# EAGLE schematic Becca Sap Flow Power Board v1_2 (EAGLE 9.6.2)
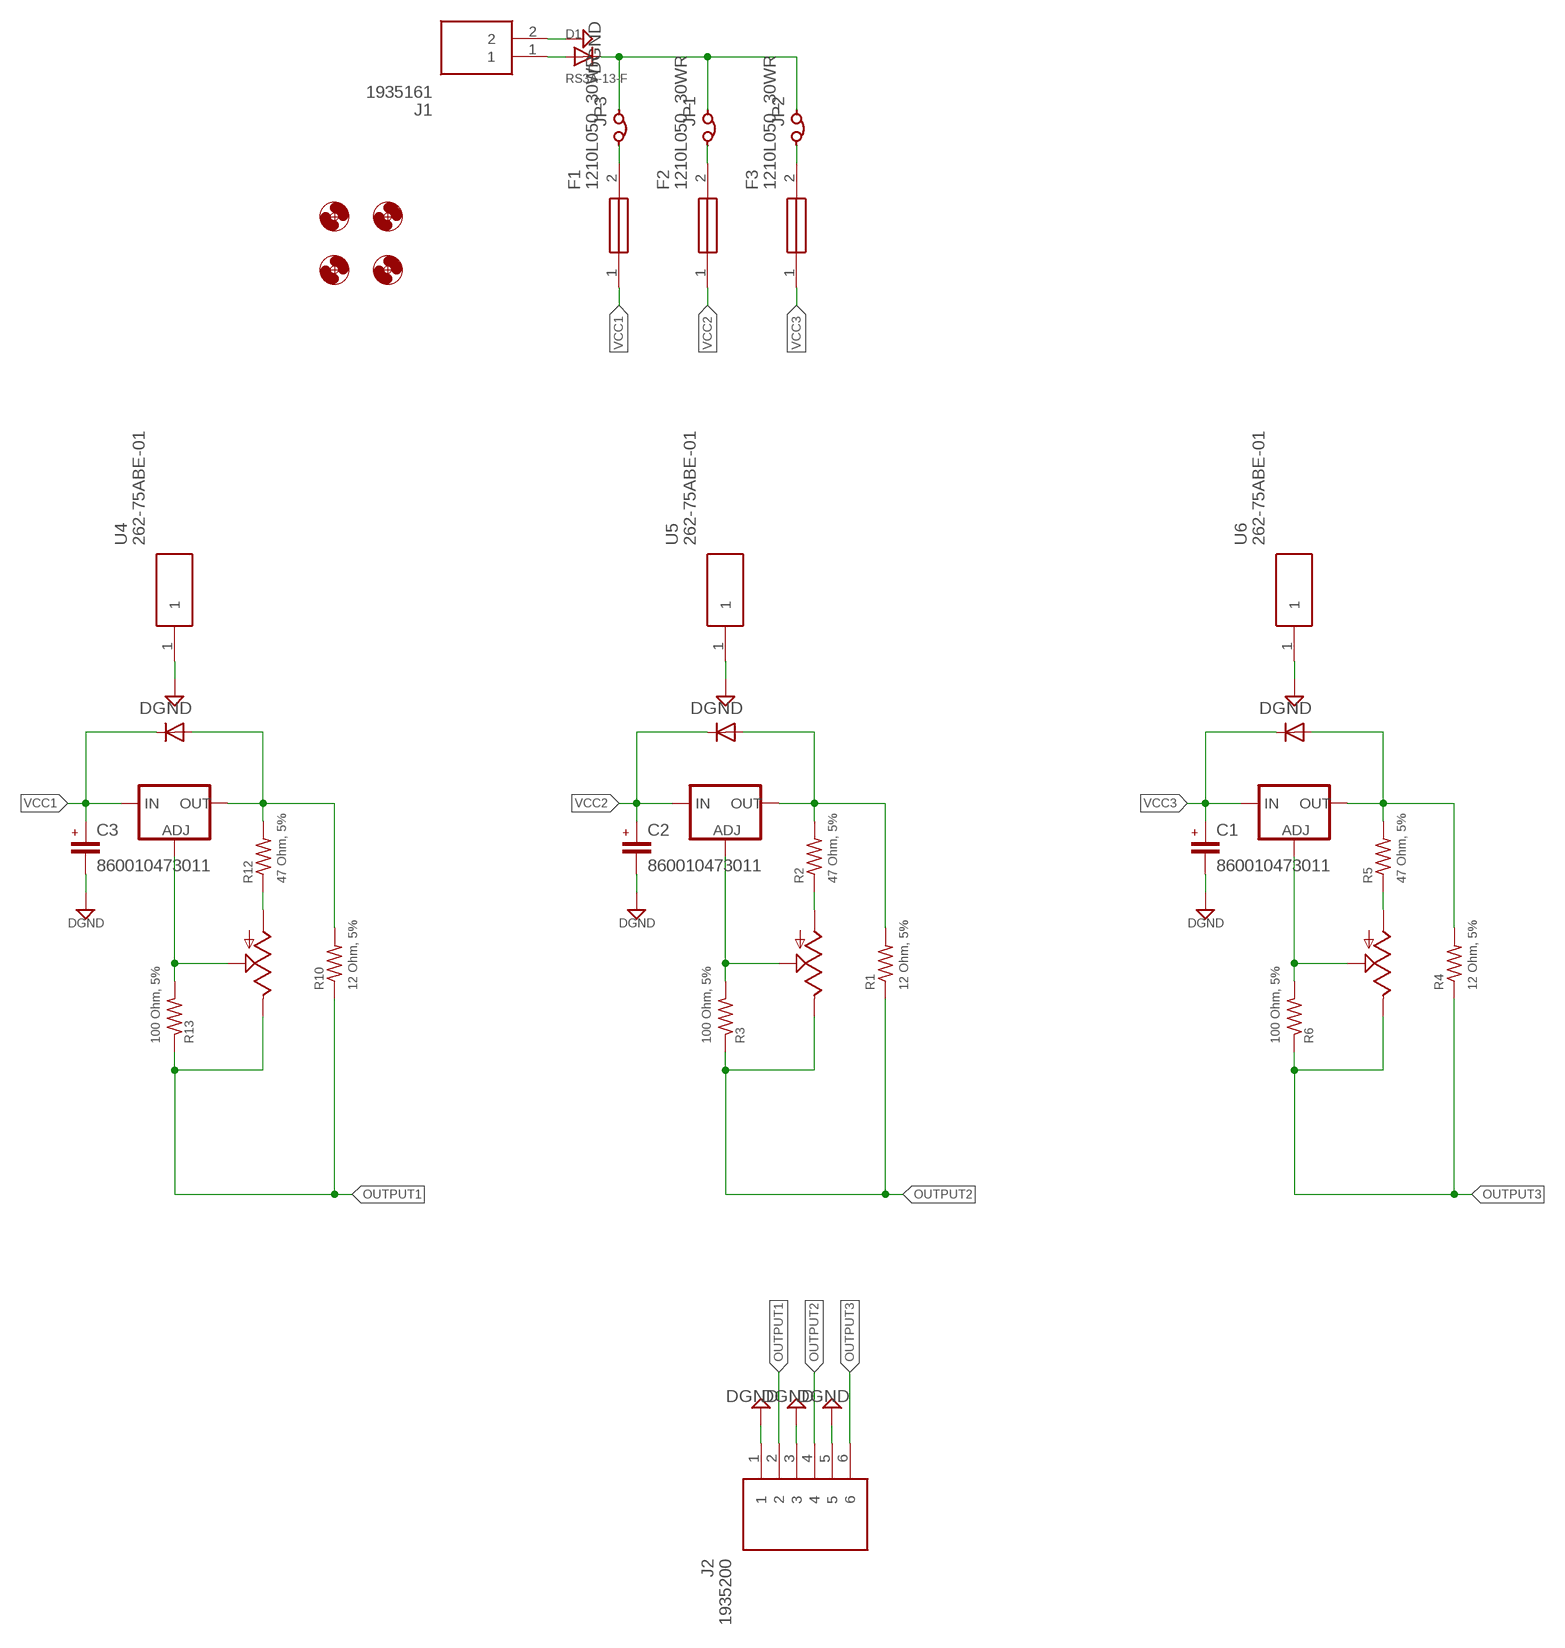
[diagram p0: schematic, sheet 1]

## Parts
C1  860010473011  [CAPPRD250W52D630H1250]
C2  860010473011  [CAPPRD250W52D630H1250]
C3  860010473011  [CAPPRD250W52D630H1250]
D1  RS3A-13-F  [DIOM7959X250N]
D3  S1A  [DIOM5027X250N]
D4  S1A  [DIOM5027X250N]
D6  S1A  [DIOM5027X250N]
F1  1210L050_30WR  [THRMC3226X125N]
F2  1210L050_30WR  [THRMC3226X125N]
F3  1210L050_30WR  [THRMC3226X125N]
J1  1935161  [1935161]
J2  1935200  [1935200]
JP1  JUMPER  [HDR2X1]
JP2  JUMPER  [HDR2X1]
JP3  JUMPER  [HDR2X1]
R1  12 Ohm, 5%  R-US_R1210  [R1210]
R2  47 Ohm, 5%  R-US_R1210  [R1210]
R3  100 Ohm, 5%  R-US_R1210  [R1210]
R4  12 Ohm, 5%  R-US_R1210  [R1210]
R5  47 Ohm, 5%  R-US_R1210  [R1210]
R6  100 Ohm, 5%  R-US_R1210  [R1210]
R10  12 Ohm, 5%  R-US_R1210  [R1210]
R12  47 Ohm, 5%  R-US_R1210  [R1210]
R13  100 Ohm, 5%  R-US_R1210  [R1210]
U1  LM317MTG  [TO254P482X997X2018-3P]
U2  LM317MTG  [TO254P482X997X2018-3P]
U3  LM317MTG  [TO254P482X997X2018-3P]
U4  262-75ABE-01  [26275ABE01]
U5  262-75ABE-01  [26275ABE01]
U6  262-75ABE-01  [26275ABE01]
U$1  MOUNT-HOLE3.0  [3,0]
U$2  MOUNT-HOLE3.0  [3,0]
U$3  MOUNT-HOLE3.0  [3,0]
U$4  MOUNT-HOLE3.0  [3,0]
VR1  3296W-1-102RLF  [3296W1102RLF]
VR2  3296W-1-102RLF  [3296W1102RLF]
VR3  3296W-1-102RLF  [3296W1102RLF]

## Nets
DGND: C1.2 C2.2 C3.2 J1.2 J2.1 J2.3 J2.5 U4.1 U5.1 U6.1
N$1: D1.1(K) JP1.1 JP2.1 JP3.1
N$2: D3.2(A) R1.2 R2.2 U2.2(OUT)
N$3: F1.2 JP3.2
N$4: F2.2 JP1.2
N$5: D1.2(A) J1.1
N$7: R3.2 U2.1(ADJ) VR2.2(S)
N$8: F3.2 JP2.2
N$10: R2.1 VR2.1(A)
N$11: D4.2(A) R4.2 R5.2 U3.2(OUT)
N$12: D6.2(A) R10.2 R12.2 U1.2(OUT)
N$13: R6.2 U3.1(ADJ) VR3.2(S)
N$14: R13.2 U1.1(ADJ) VR1.2(S)
N$15: R12.1 VR1.1(A)
N$16: R5.1 VR3.1(A)
OUTPUT1: J2.2 R10.1 R13.1 VR1.3(E)
OUTPUT2: J2.4 R1.1 R3.1 VR2.3(E)
OUTPUT3: J2.6 R4.1 R6.1 VR3.3(E)
VCC1: C3.1 D6.1(K) F1.1 U1.3(IN)
VCC2: C2.1 D3.1(K) F2.1 U2.3(IN)
VCC3: C1.1 D4.1(K) F3.1 U3.3(IN)

## Library data of the parts
C1-C3 = Becca-Sap-Flow-LORA:860010473011: Wurth Elektronik 220uF 25 V dc Aluminium Electrolytic Capacitor, WCAP-ATG8 Series 2000h 6.3 (Dia.) x 11mm Source: Datasheet <https://www.we-online.de/katalog/datasheet/860010473011.pdf>; DESCRIPTION: Wurth Elektronik 220uF 25 V dc Aluminium Electrolytic Capacitor, WCAP-ATG8 Series 2000h 6.3 (Dia.) x 11mm; HEIGHT: 12.5mm; MANUFACTURER_NAME: Wurth Elektronik; MANUFACTURER_PART_NUMBER: 860010473011; MOUSER_PART_NUMBER: 710-860010473011; MOUSER_PRICE-STOCK: https://www.mouser.co.uk/ProductDetail/Wurth-Elektronik/860010473011?qs=0KOYDY2FL2%252Bm07azjhm%2FHQ%3D%3D
D1 = Becca-Sap-Flow-LORA:RS3A-13-F: DIODE GEN PURP 50V 3A SMC Source: Datasheet <https://componentsearchengine.com/Datasheets/1/RS3A-13-F.pdf>; DESCRIPTION: DIODE GEN PURP 50V 3A SMC; HEIGHT: 2.5mm; MANUFACTURER_NAME: Diodes Incorporated; MANUFACTURER_PART_NUMBER: RS3A-13-F; MOUSER_PART_NUMBER: 621-RS3A-13-F; MOUSER_PRICE-STOCK: https://www.mouser.com/Search/Refine.aspx?Keyword=621-RS3A-13-F
D3 D4 D6 = Becca-Sap-Flow-LORA:S1A: Rectifier Diode Switching 50V 1A 1500ns 2-Pin SMA T/R Source: Datasheet <https://diotec.com/request/datasheet/s1a.pdf>; DESCRIPTION: Rectifier Diode Switching 50V 1A 1500ns 2-Pin SMA T/R; HEIGHT: 2.5mm; MANUFACTURER_NAME: Diotec; MANUFACTURER_PART_NUMBER: S1A; MOUSER_PART_NUMBER: 637-S1A; MOUSER_PRICE-STOCK: https://www.mouser.co.uk/ProductDetail/Diotec-Semiconductor/S1A?qs=OlC7AqGiEDlqVjQP70PTqA%3D%3D
F1-F3 = Becca-Sap-Flow-LORA:1210L050_30WR: Resettable Fuses - PPTC PTC 30V POLYFUSE SURF MOUNT 1210 0.5A Source: Datasheet <https://componentsearchengine.com/Datasheets/1/1210L050_30WR.pdf>; DESCRIPTION: Resettable Fuses - PPTC PTC 30V POLYFUSE SURF MOUNT 1210 0.5A; HEIGHT: 1.25mm; MANUFACTURER_NAME: LITTELFUSE; MANUFACTURER_PART_NUMBER: 1210L050/30WR; MOUSER_PART_NUMBER: 576-1210L050/30WR; MOUSER_PRICE-STOCK: https://www.mouser.co.uk/ProductDetail/Littelfuse/1210L050-30WR?qs=lM4gFlnEeEOvFoAkPA9Mhg%3D%3D
J1 = Becca-Sap-Flow-LORA:1935161: Phoenix Contact COMBICON PT PCB Terminal Block, 2 Way/Pole, Screw Terminals, 26 14 AWG Through Hole, Nylon Source: Datasheet <https://datasheet.datasheetarchive.com/originals/distributors/SFDatasheet-2/sf-00057459.pdf>; DESCRIPTION: Phoenix Contact COMBICON PT PCB Terminal Block, 2 Way/Pole, Screw Terminals, 26 14 AWG Through Hole, Nylon; HEIGHT: 11.55mm; MANUFACTURER_NAME: Phoenix Contact; MANUFACTURER_PART_NUMBER: 1935161; MOUSER_PART_NUMBER: 651-1935161; MOUSER_PRICE-STOCK: https://www.mouser.co.uk/ProductDetail/Phoenix-Contact/1935161?qs=W3wJikR1%252BS6eKzfFl8Rbew%3D%3D
J2 = Becca-Sap-Flow-LORA:1935200: Fixed Terminal Blocks PT 1.5/6-5.0-H Source: Datasheet <https://datasheet.datasheetarchive.com/originals/distributors/SFDatasheet-2/sf-00057463.pdf>; DESCRIPTION: Fixed Terminal Blocks PT 1.5/6-5.0-H; HEIGHT: 11.55mm; MANUFACTURER_NAME: Phoenix Contact; MANUFACTURER_PART_NUMBER: 1935200; MOUSER_PART_NUMBER: 651-1935200; MOUSER_PRICE-STOCK: https://www.mouser.co.uk/ProductDetail/Phoenix-Contact/1935200?qs=8BCRtFWWXOTOyOTMiNRITA%3D%3D
JP1-JP3 = Becca-Sap-Flow-LORA:JUMPER: Wire jumper .1" C
R1-R6 R10 R12 R13 = Becca-Sap-Flow-LORA:R-US_: RESISTOR, American symbol; SPICEPREFIX: R
U1-U3 = Becca-Sap-Flow-LORA:LM317MTG: Internal Short Circuit Current Limiting; Internal Thermal Overload Protection; Output Current in Excess of 500 mA; Output Transistor Safe-Area Compensation; Output Adjustable between 1.2 V and 37 V; Floating Operation for High Voltage Applications; Eliminates Stocking Many Fixed Voltages; Pb-Free Packages are Available; NCV Prefix for Automotive and Other Applications Requiring Site Control Changes Source: Datasheet <https://www.onsemi.com/pub/Collateral/LM317M-D.PDF>; DESCRIPTION: Internal Short Circuit Current Limiting; Internal Thermal Overload Protection; Output Current in Excess of 500 mA; Output Transistor Safe-Area Compensation; Output Adjustable between 1.2 V and 37 V; Floating Operation for High Voltage Applications; Eliminates Stocking Many Fixed Voltages; Pb-Free Packages are Available; NCV Prefix for Automotive and Other Applications Requiring Site Control Changes; HEIGHT: 4.82mm; MANUFACTURER_NAME: onsemi; MANUFACTURER_PART_NUMBER: LM317MTG; MOUSER_PART_NUMBER: 863-LM317MTG; MOUSER_PRICE-STOCK: https://www.mouser.co.uk/ProductDetail/onsemi/LM317MTG?qs=2OtswVQKCOHbXYkL9fERIw%3D%3D
U4-U6 = Becca-Sap-Flow-LORA:262-75ABE-01: Heat Sinks Horizontal and Vertical Mount Heat Sink for TO-220, Aluminum, 13.4x12.7x19.1mm Source: Datasheet <https://wakefieldthermal.com/content/data_sheets/234.pdf>; DESCRIPTION: Heat Sinks Horizontal and Vertical Mount Heat Sink for TO-220, Aluminum, 13.4x12.7x19.1mm; HEIGHT: 19.1mm; MANUFACTURER_NAME: Wakefield Thermal; MANUFACTURER_PART_NUMBER: 262-75ABE-01; MOUSER_PART_NUMBER: 567-262-75AB-01E; MOUSER_PRICE-STOCK: https://www.mouser.co.uk/ProductDetail/Wakefield-Vette/262-75ABE-01?qs=fkDBU5YyzSHxguVX7sHNMA%3D%3D
U$1-U$4 = Becca-Sap-Flow-LORA:MOUNT-HOLE: MOUNTING HOLE with drill center marker
VR1-VR3 = Becca-Sap-Flow-LORA:3296W-1-102RLF: 1 kOhms 0.5W, 1/2W PC Pins Through Hole Trimmer Potentiometer Cermet 25.0 Turn Top Adjustment Source: Datasheet <https://www.bourns.com/docs/Product-Datasheets/3296.pdf>; DESCRIPTION: 1 kOhms 0.5W, 1/2W PC Pins Through Hole Trimmer Potentiometer Cermet 25.0 Turn Top Adjustment; HEIGHT: 11.8mm; MANUFACTURER_NAME: Bourns; MANUFACTURER_PART_NUMBER: 3296W-1-102RLF; MOUSER_PART_NUMBER: 652-3296W-1-102RLF; MOUSER_PRICE-STOCK: https://www.mouser.co.uk/ProductDetail/Bourns/3296W-1-102RLF?qs=oM%2FE6%2FUWOpR5bwX1MfrWeA%3D%3D

## Net classes
1 highpower: width 0.305 mm, drill 0.483 mm